# Altium schematic sheet POE_UART_hall_crossboard_1_1.SchDoc
size A3
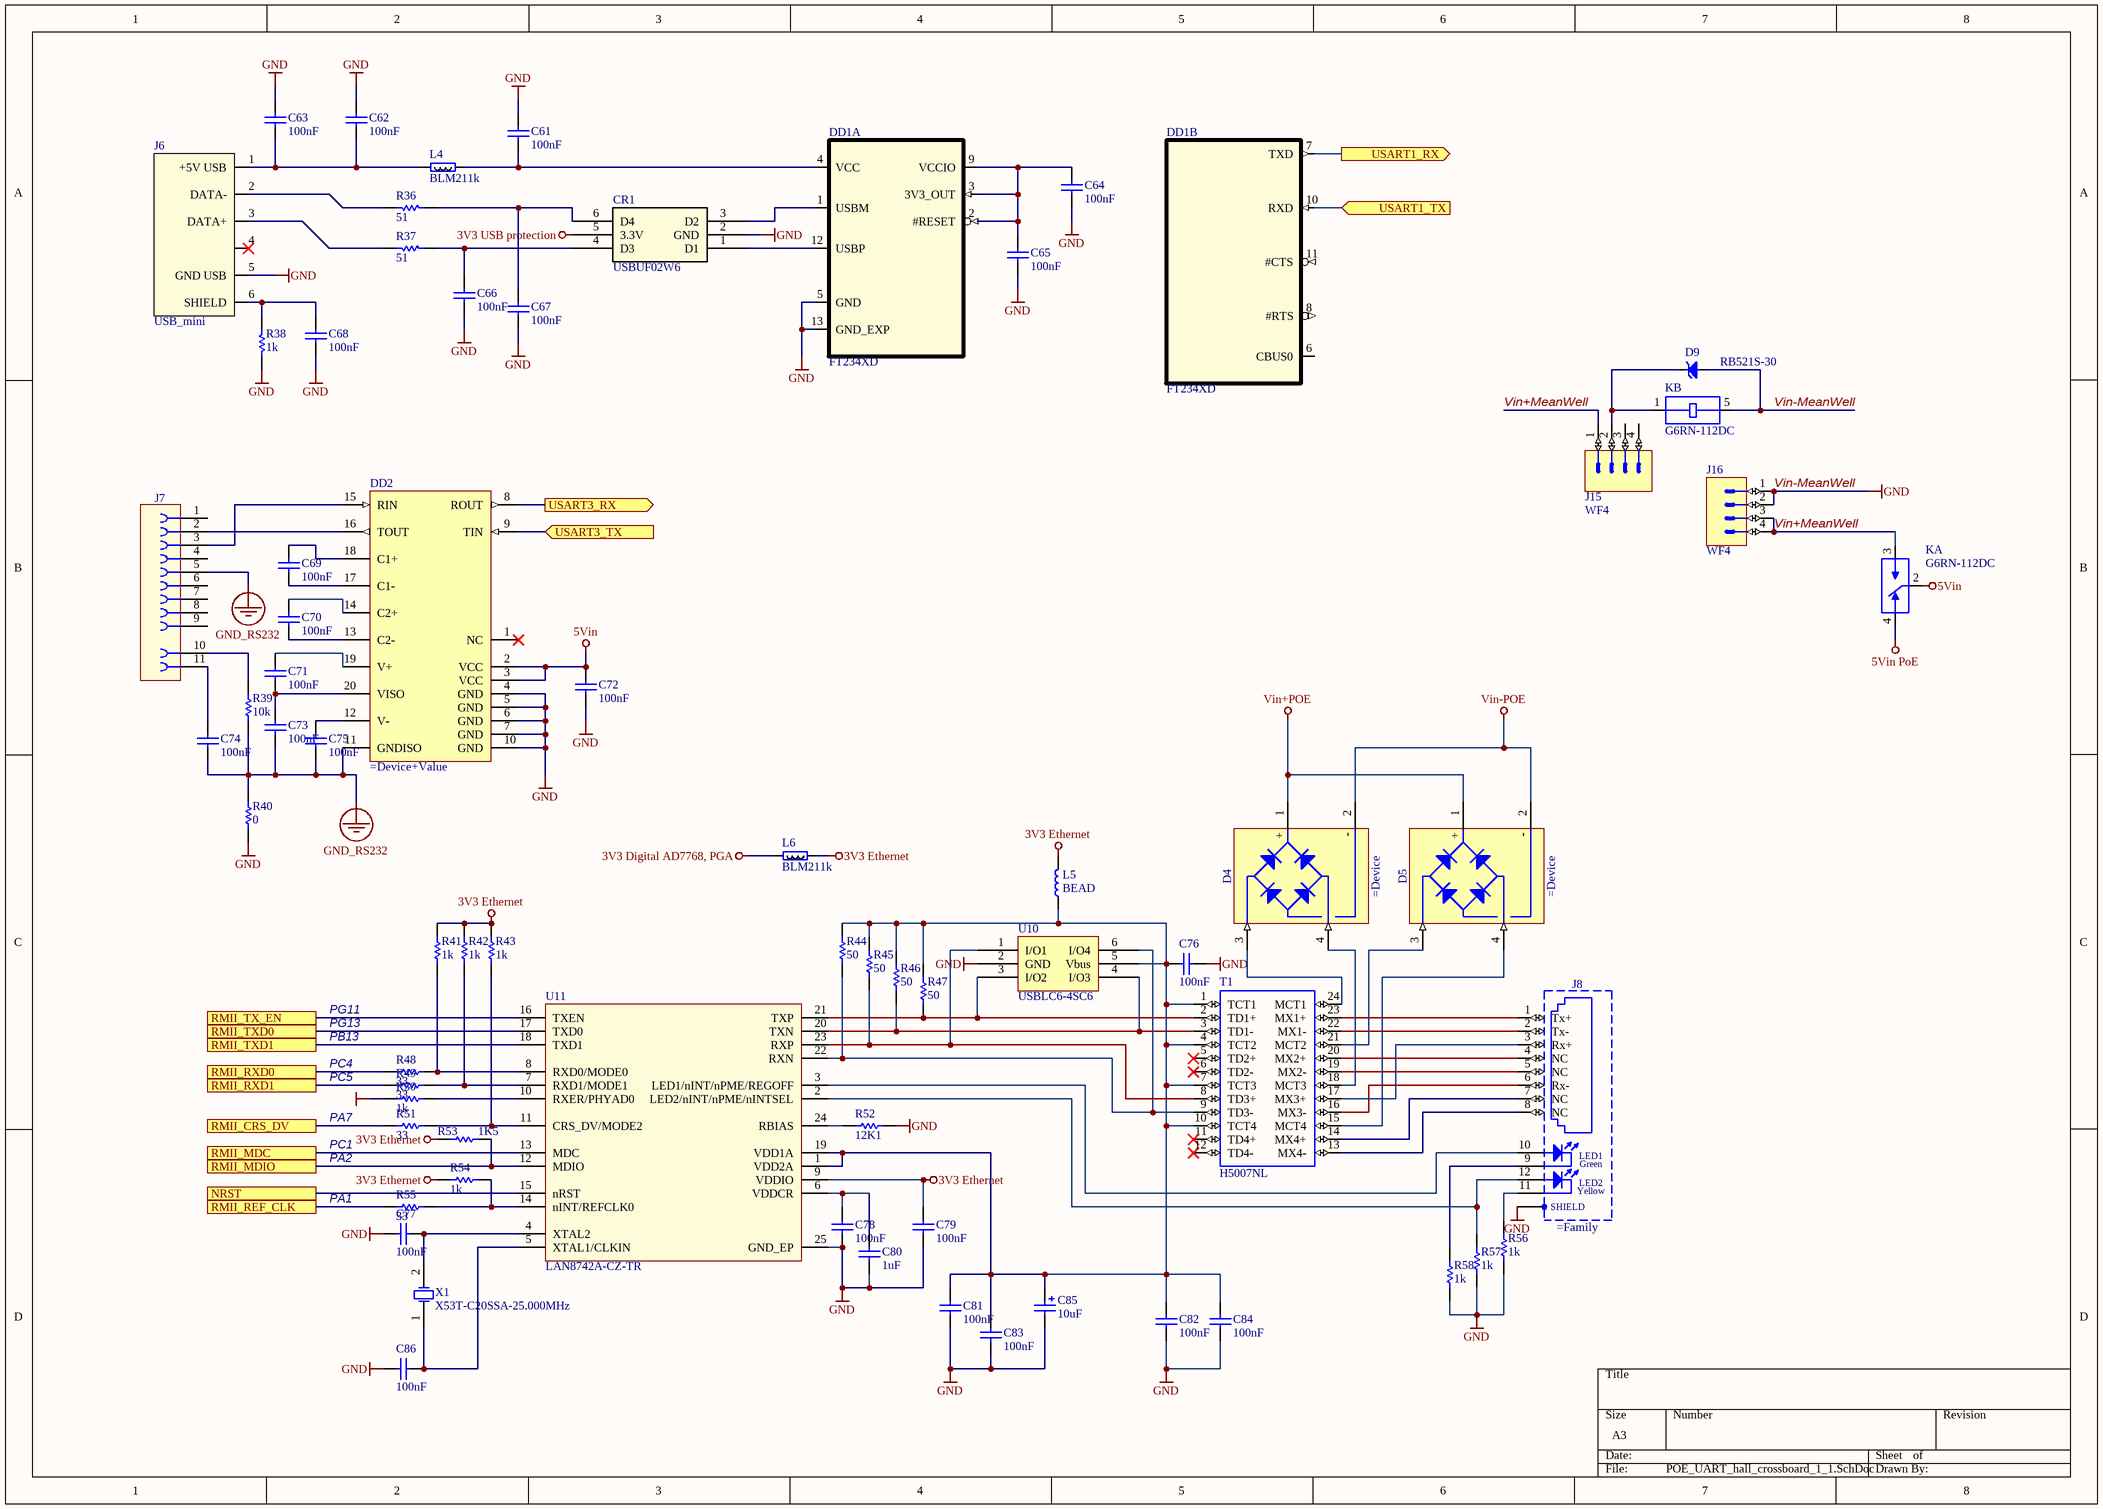
[diagram p0: POE_UART_hall_crossboard_1_1.SchDoc]

## Parts
C61  100nF  [0603C]
C62  100nF  [0603C]
C63  100nF  [0603C]
C64  100nF  [0603C]
C65  100nF  [0603C]
C66  100nF  [0603C]
C67  100nF  [0603C]
C68  100nF  [0603C]
C69  100nF  [0603C]
C70  100nF  [0603C]
C71  100nF  [0603C]
C72  100nF  [0603C]
C73  100nF  [0603C]
C74  100nF  [0603C]
C75  100nF  [0603C]
C76  100nF  [0603C]
C77  100nF  [0603C]
C78  100nF  [0603C]
C79  100nF  [0603C]
C80  1uF  [0805C]
C81  100nF  [0603C]
C82  100nF  [0603C]
C83  100nF  [0603C]
C84  100nF  [0603C]
C85  10uF  [0805C]
C86  100nF  [0603C]
CR1  USBUF02W6  [SOTT323-6L_STM-M]
D4  (no value)
D5  (no value)
D9  RB521S-30  [SODFL1608X65N]
DD1  FT234XD  [DFN_12-045]  (parts A,B of 2)
DD2  (no value)  [SOIC127P1032X265-20N]
J6  USB_mini  [TYCO_1734035-1]
J7  (no value)  [TYCO_5747844-5]
J8  (no value)  [AMPHENOL_RJHSE-5381]
J15  WF4  [WF4_2_54]
J16  WF4  [WF4_2_54]
K  G6RN-112DC  [RELAY_G6RN-1_12DC]  (parts A,B of 2)
L4  BLM211k  [RESC2012X50N]
L5  BEAD  [0603L]
L6  BLM211k  [RESC2012X50N]
R36  51  [0603R]
R37  51  [0603R]
R38  1k  [0603R]
R39  10k  [0603R]
R40  0  [0603R]
R41  1k  [0603R]
R42  1k  [0603R]
R43  1k  [0603R]
R44  50  [0603R]
R45  50  [0603R]
R46  50  [0603R]
R47  50  [0603R]
R48  33  [0603R]
R49  33  [0603R]
R50  1k  [0603R]
R51  33  [0603R]
R52  12K1  [0603R]
R53  1K5  [0603R]
R54  1k  [0603R]
R55  33  [0603R]
R56  1k  [0603R]
R57  1k  [0603R]
R58  1k  [0603R]
T1  H5007NL  [SOIC127P1600X551-24N]
U10  USBLC6-4SC6  [SOT23-6L]
U11  LAN8742A-CZ-TR  [QFN24_0R5_4X4]
X1  X53T-C20SSA-25.000MHz  [XTAL_2SM_5R0X3R2]

## Ports
NRST, RMII_CRS_DV, RMII_MDC, RMII_MDIO, RMII_REF_CLK, RMII_RXD0, RMII_RXD1, RMII_TX_EN, RMII_TXD0, RMII_TXD1, USART1_RX (out), USART1_TX (in), USART3_RX (out), USART3_TX (in)

## Nets
3V3 Digital AD7768, PGA: L6.2
3V3 Ethernet: C79.2 L5.2 L6.1 R41.2 R42.2 R43.2 R53.2 R54.1 U11.9(VDDIO)
3V3 USB protection: CR1.5(3.3V)
5Vin: C72.2 DD2.2(VCC) DD2.3(VCC) K.2(COM)
5Vin PoE: K.4(NC)
GND_RS232: C73.1 C74.1 C75.1 DD2.11(GNDISO) J7.5 R39.2 R40.1
Vin+POE: D4.1(+) D5.1(+)
Vin-MeanWell: C61.2 C62.2 C63.2 C64.1 C65.1 C66.2 C67.1 C68.1 C72.1 C76.1 C77.2 C78.1 C79.1 C80.1 C81.1 C82.1 C83.1 C84.1 C85.2 C86.2 CR1.2(GND) D9.2(A) DD1.5(GND) DD1.13(GND_EXP) DD2.4(GND) DD2.5(GND) DD2.6(GND) DD2.7(GND) DD2.10(GND) J6.5(GND_USB) J8.SHIELD J16.1 J16.2 K.5(COIL2) R38.1 R40.2 R50.1 R52.2 R56.1 R57.1 R58.1 U10.2(GND) U11.25(GND_EP)  [also labelled GND]
Vin-POE: D4.2(-) D5.2(-)
NRST: U11.15(nRST) ; port NRST
RMII_CRS_DV: R51.1 ; port RMII_CRS_DV
RMII_MDC: U11.13(MDC) ; port RMII_MDC
RMII_MDIO: R53.1 U11.12(MDIO) ; port RMII_MDIO
RMII_REF_CLK: R55.1 ; port RMII_REF_CLK
RMII_RXD0: R48.1 ; port RMII_RXD0
RMII_RXD1: R49.1 ; port RMII_RXD1
RMII_TX_EN: U11.16(TXEN) ; port RMII_TX_EN
RMII_TXD0: U11.17(TXD0) ; port RMII_TXD0
RMII_TXD1: U11.18(TXD1) ; port RMII_TXD1
USART1_RX: DD1.7(TXD) ; port USART1_RX
USART1_TX: DD1.10(RXD) ; port USART1_TX
USART3_RX: DD2.8(ROUT) ; port USART3_RX
USART3_TX: DD2.9(TIN) ; port USART3_TX
Vin+MeanWell: J15.1 J16.3 J16.4 K.3(NO)
NetC61_1: C61.1 DD1.4(VCC) L4.1
NetC62_1: C62.1 C63.1 J6.1(+5V_USB) L4.2
NetC64_2: C64.2 C65.2 DD1.2(#RESET) DD1.3(3V3_OUT) DD1.9(VCCIO)
NetC66_1: C66.1 CR1.4(D3) R37.1
NetC67_2: C67.2 CR1.6(D4) R36.1
NetC68_2: C68.2 J6.6(SHIELD) R38.2
NetC69_1: C69.1 DD2.17(C1-)
NetC69_2: C69.2 DD2.18(C1+)
NetC70_1: C70.1 DD2.13(C2-)
NetC70_2: C70.2 DD2.14(C2+)
NetC71_1: C71.1 C73.2 DD2.20(VISO)
NetC71_2: C71.2 DD2.19(V+)
NetC74_2: C74.2 J7.11
NetC75_2: C75.2 DD2.12(V-)
NetC76_2: C76.2 C81.2 C82.2 C83.2 C84.2 C85.1 L5.1 R44.2 R45.2 R46.2 R47.2 T1.1(TCT1) T1.4(TCT2) T1.7(TCT3) T1.10(TCT4) U10.5(Vbus) U11.1(VDD2A) U11.19(VDD1A)
NetC77_1: C77.1 U11.4(XTAL2) X1.2(OSC2)
NetC78_2: C78.2 C80.2 U11.6(VDDCR)
NetC86_1: C86.1 U11.5(XTAL1/CLKIN) X1.1(OSC1)
NetCR1_1: CR1.1(D1) DD1.12(USBP)
NetCR1_3: CR1.3(D2) DD1.1(USBM)
NetD4_3: D4.3(AC) T1.24(MCT1)
NetD4_4: D4.4(AC) T1.18(MCT3)
NetD5_3: D5.3(AC) T1.21(MCT2)
NetD5_4: D5.4(AC) T1.15(MCT4)
NetD9_1: D9.1(C) J15.2 K.1(COIL1)
NetDD2_15: DD2.15(RIN) J7.3
NetDD2_16: DD2.16(TOUT) J7.2
NetJ6_2: J6.2(DATA-) R36.2
NetJ6_3: J6.3(DATA+) R37.2
NetJ7_10: J7.10 R39.1
NetJ8_1: J8.1(Tx+) T1.23(MX1+)
NetJ8_2: J8.2(Tx-) T1.22(MX1-)
NetJ8_3: J8.3(Rx+) T1.17(MX3+)
NetJ8_4: J8.4(NC) T1.20(MX2+)
NetJ8_5: J8.5(NC) T1.19(MX2-)
NetJ8_6: J8.6(Rx-) T1.16(MX3-)
NetJ8_7: J8.7(NC) T1.14(MX4+)
NetJ8_8: J8.8(NC) T1.13(MX4-)
NetJ8_9: J8.9(CLED1) R58.2
NetJ8_10: J8.10(ALED1) U11.3(LED1/nINT/nPME/REGOFF)
NetJ8_11: J8.11(ALED2) R56.2
NetJ8_12: J8.12(CLED2) R57.2 U11.2(LED2/nINT/nPME/nINTSEL)
NetR41_1: R41.1 R48.2 U11.8(RXD0/MODE0)
NetR42_1: R42.1 R49.2 U11.7(RXD1/MODE1)
NetR43_1: R43.1 R51.2 U11.11(CRS_DV/MODE2)
NetR44_1: R44.1 T1.9(TD3-) U10.6(I/O4) U11.22(RXN)
NetR45_1: R45.1 T1.8(TD3+) U10.1(I/O1) U11.23(RXP)
NetR46_1: R46.1 T1.3(TD1-) U10.4(I/O3) U11.20(TXN)
NetR47_1: R47.1 T1.2(TD1+) U10.3(I/O2) U11.21(TXP)
NetR50_2: R50.2 U11.10(RXER/PHYAD0)
NetR52_1: R52.1 U11.24(RBIAS)
NetR54_2: R54.2 R55.2 U11.14(nINT/REFCLK0)

Not connected (* = marked no-connect by the designer): DD1 6(CBUS0) 8(#RTS) 11(#CTS); DD2 1(NC)*; J6 4*; J7 1 4 6 7 8 9; J15 3 4; T1 5(TD2+)* 6(TD2-)* 11(TD4+)* 12(TD4-)*

## Notes on the sheet
- PG11
- PG13
- PB13
- PC4
- PC5
- PA7
- PC1
- PA2
- PA1
- (in symbol AMPHENOL_RJHSE-5381) LED1; Green; LED2; Yellow

## Library data of the parts
C61-C84 C86 = Capacitor_ST: Capacitor 0402 / 0603 / 0805; Revision: July-2002: Re-released for DXP Platform.
  C61-C79 C81-C84 C86: Value: 100nF
  C80: Value: 1uF
C85 = Cap_10uF_POL_10%_TANA: Polarized Capacitor,10uF,10V,10%,typeA,VISHAY; Manuf_Part_1: 293D106X9010A2TE3; Revision: July-2002: Re-released for DXP Platform.; Value: 10uF; Manuf_1: VISHAY; Order: *; ECCN_US/EU: n/a
CR1 = USBUF02W6: USB protection; Mfr_Name: STMicroelectronics; RefDes: RefDes; Type: Type
D4 D5 = Bridge Rectifier 1+ 2AC 3- 4AC
D9 = RB521S-30: Чип Шоттки диод; Vendor: CTK; Voltage: 30V; SMD Solders: 2; Solder Option: RM; Pkg: SOD523; Price: 5; Device: RB521S-30; Name to order: RB521S-30
DD1 = FT234XD: USB-UART driver; Vendor: FTDI; SMD Solders: 7; THD Solders: 0; Device: FT234XD; Package: DFN_12-0.45; Unit Price: 2
DD2 = ADM3251: Driver UART-RS232; Vendor: Analog Devices; SMD Solder: 20; THD Solder: 0; Unit_Price: 1200; Device: ADM3251; Unit Price: 6; Package: SOICW20; SolderOption: 0
J6 = USB_mini: Вилка  PLS 6x2.54; Vendor: TE Connectivity; SolderOption: Norm; Price: 50; Value: USB_mini
J7 = Connector 9 Female: Solder Option: 0; THD Solders: 11; SMD Solders: 0; Vendor: *; Value: *
J8 = AMPHENOL_RJHSE-5381: 1 Port, 8 Positions, CAT5 RJ45 Modular Connector With Yellow And Green LEDs
J15 J16 = WF4: Вилка  WF4; Vendor: Confly; SMD Solders: 0; Solder Option: RM; THD Solders: 4; Price: 20; Device: WF4
K = G6RN-112DC: General Purpose Relay SPST-NO _1 Form A_ 12VDC Coil Through Hole; MF: Omron Electronics; Value: *; Availability: Unavailable; Package: Custom Package Omron Electronics Inc.; Price: None; SnapEDA_Link: https://www.snapeda.com/parts/G6RN-1%2012DC/Omron%20Electronics%20Inc-EMC%20Div/view-part/490385/?ref=snap; MP: G6RN-1 12DC
L4 L6 = BLM21: SMD Ferrite bead 0805; Vendor: Vishay; Value: 1k; Pkg: SMD0805; SMD Solders: 2; Solder Option: RM; Device: BLM21; Price: 10
L5 = Inductor: Value: 100uH; Published: 8-Jun-2000; Revision: July-2002: Re-released for DXP Platform.; Publisher: Altium Limited
R36 R37 R40 R48 R49 R51 R52 R55 = Resistor_ST: Resistor 0402 / 0603 / 0805; Value: 10K
R38 R41-R47 R50 R54 R56-R58 = Resistor_ST: Resistor 0402 / 0603 / 0805
  R38 R41-R43 R50 R54 R56-R58: Value: 1k
  R44-R47: Value: 50
R39 = Resistor_ST: Resistor; Value: 1K; Ordered by: Subcon; Published: 8-Jun-2000; Revision: July-2002: Re-released for DXP Platform.; Publisher: Altium Limited
R53 = Res_1K5_1%_0402: Resistor,1K5,0402,1%,YAGEO; Manuf_Part_1: RC0402FR-071K5L; Value: 1K5; Manuf_1: YAGEO; Order: RC0402FR-071K5L; ECCN_US/EU: n/a; Distrib: FARNELL
T1 = H5007NL: Isolation and Data Interface _Encapsulated_ Pulse Transformer 1CT:1CT Surface Mount; MP: H5007NL-T; MF: Pulse Electronics; Package: Pulse Electronics; SnapEDA_Link: https://www.snapeda.com/parts/H5007NL-T/Pulse%20Electronics%20Network/view-part/2770413/?ref=snap; Value: *; Availability: Unavailable; Price: None
U11 = LAN8742A-CZ-TR: LAN8742A-CZ-TR - Small Footprint RMII 10/100 Ethernet, Transceiver with HP Auto-MDIX and flexPWR Technology SQFN-24; Manuf_1: MICROCHIP; Order: LAN8742A-CZ-TR; Manuf_Part_1: LAN8742A-CZ-TR; Distrib: MICROCHIP
X1 = XTAL_5032: Crystal Oscillator; Published: 8-Jun-2000; LatestRevisionDate: 17-Jul-2002; LatestRevisionNote: Re-released for DXP Platform.; PackageReference: R38; Publisher: Altium Limited